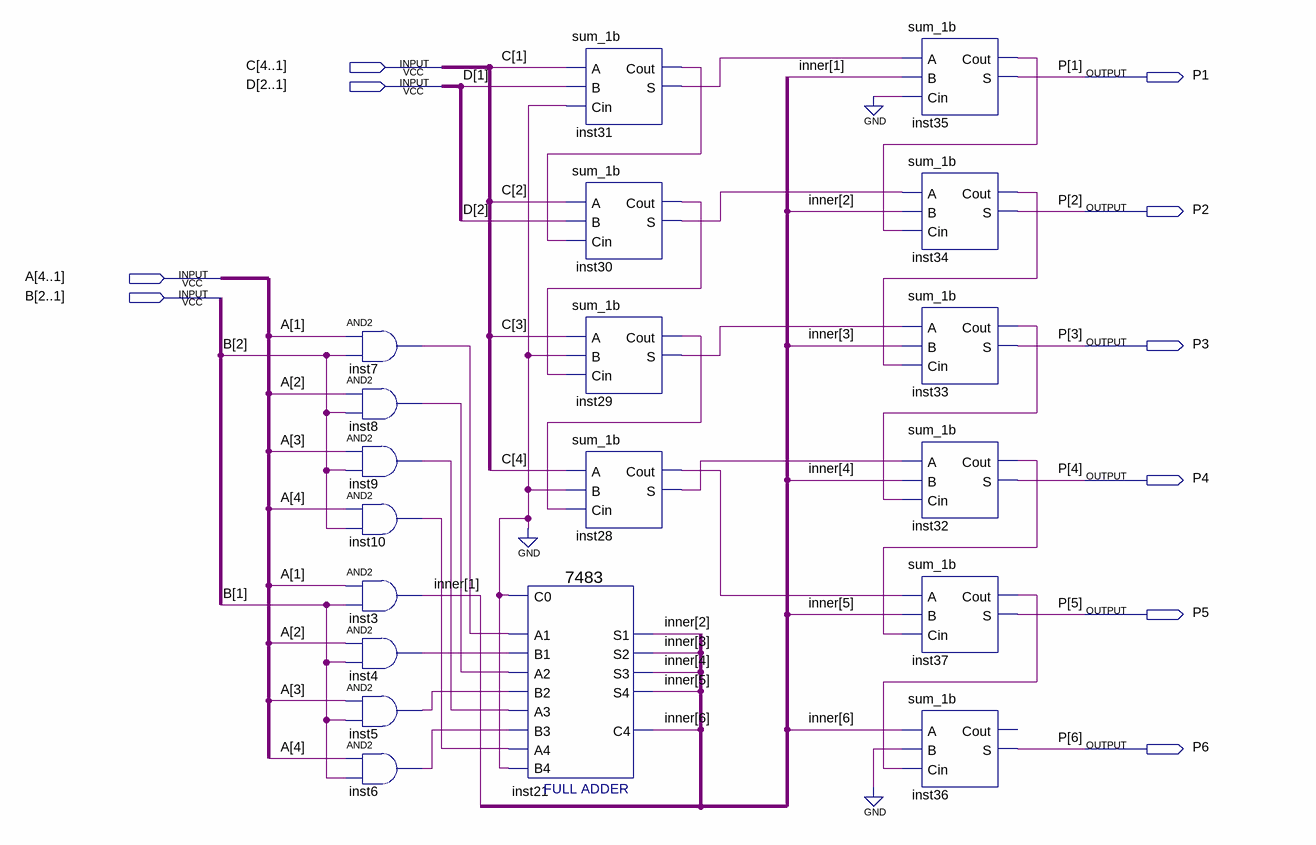
[diagram p0: schematic sheet]
// Quartus schematic msb4_2.bdf as structural Verilog: 19 symbols, 10 pins
module msb4_2 (
  input  [4:1] C,
  input  [2:1] D,
  input  [4:1] A,
  input  [2:1] B,
  output P1,
  output P2,
  output P3,
  output P4,
  output P5,
  output P6
);

  wire inst4_out, inst5_out, inst6_out, inst7_out, inst8_out, inst9_out, inst10_out, inst28_cout, inst28_s,
       inst29_cout, inst29_s, inst30_cout, inst30_s, inst31_cout, inst31_s, inst32_cout, inst33_cout,
       inst34_cout, inst35_cout, inst37_cout;
  wire [6:1] inner;

  and inst7 (inst7_out, A[1], B[2]);
  and inst8 (inst8_out, A[2], B[2]);
  and inst9 (inst9_out, A[3], B[2]);
  and inst10 (inst10_out, A[4], B[2]);
  and inst3 (inner[1], A[1], B[1]);
  and inst4 (inst4_out, A[2], B[1]);
  and inst5 (inst5_out, A[3], B[1]);
  and inst6 (inst6_out, A[4], B[1]);
  \7483  inst21 (
    .B4(1'b0), .C0(1'b0), .A1(inst7_out), .A2(inst8_out), .B1(inst4_out), .B2(inst5_out), .A3(inst9_out),
    .B3(inst6_out), .A4(inst10_out), .S3(inner[4]), .S4(inner[5]), .S2(inner[3]), .C4(inner[6]), .S1(inner[2]));
  sum_1b inst31 (.A(C[1]), .B(D[1]), .Cin(1'b0), .Cout(inst31_cout), .S(inst31_s));
  sum_1b inst30 (.A(C[2]), .B(D[2]), .Cin(inst31_cout), .Cout(inst30_cout), .S(inst30_s));
  sum_1b inst29 (.A(C[3]), .B(1'b0), .Cin(inst30_cout), .Cout(inst29_cout), .S(inst29_s));
  sum_1b inst28 (.A(C[4]), .B(1'b0), .Cin(inst29_cout), .Cout(inst28_cout), .S(inst28_s));
  sum_1b inst35 (.A(inst31_s), .B(inner[1]), .Cin(1'b0), .Cout(inst35_cout), .S(P1));
  sum_1b inst34 (.A(inst30_s), .B(inner[2]), .Cin(inst35_cout), .Cout(inst34_cout), .S(P2));
  sum_1b inst33 (.A(inst29_s), .B(inner[3]), .Cin(inst34_cout), .Cout(inst33_cout), .S(P3));
  sum_1b inst32 (.A(inst28_s), .B(inner[4]), .Cin(inst33_cout), .Cout(inst32_cout), .S(P4));
  sum_1b inst37 (.A(inst28_cout), .B(inner[5]), .Cin(inst32_cout), .Cout(inst37_cout), .S(P5));
  sum_1b inst36 (.A(inner[6]), .B(1'b0), .Cin(inst37_cout), .S(P6));  // open: Cout
endmodule
